# EAGLE design interface (EAGLE 7.7.0)
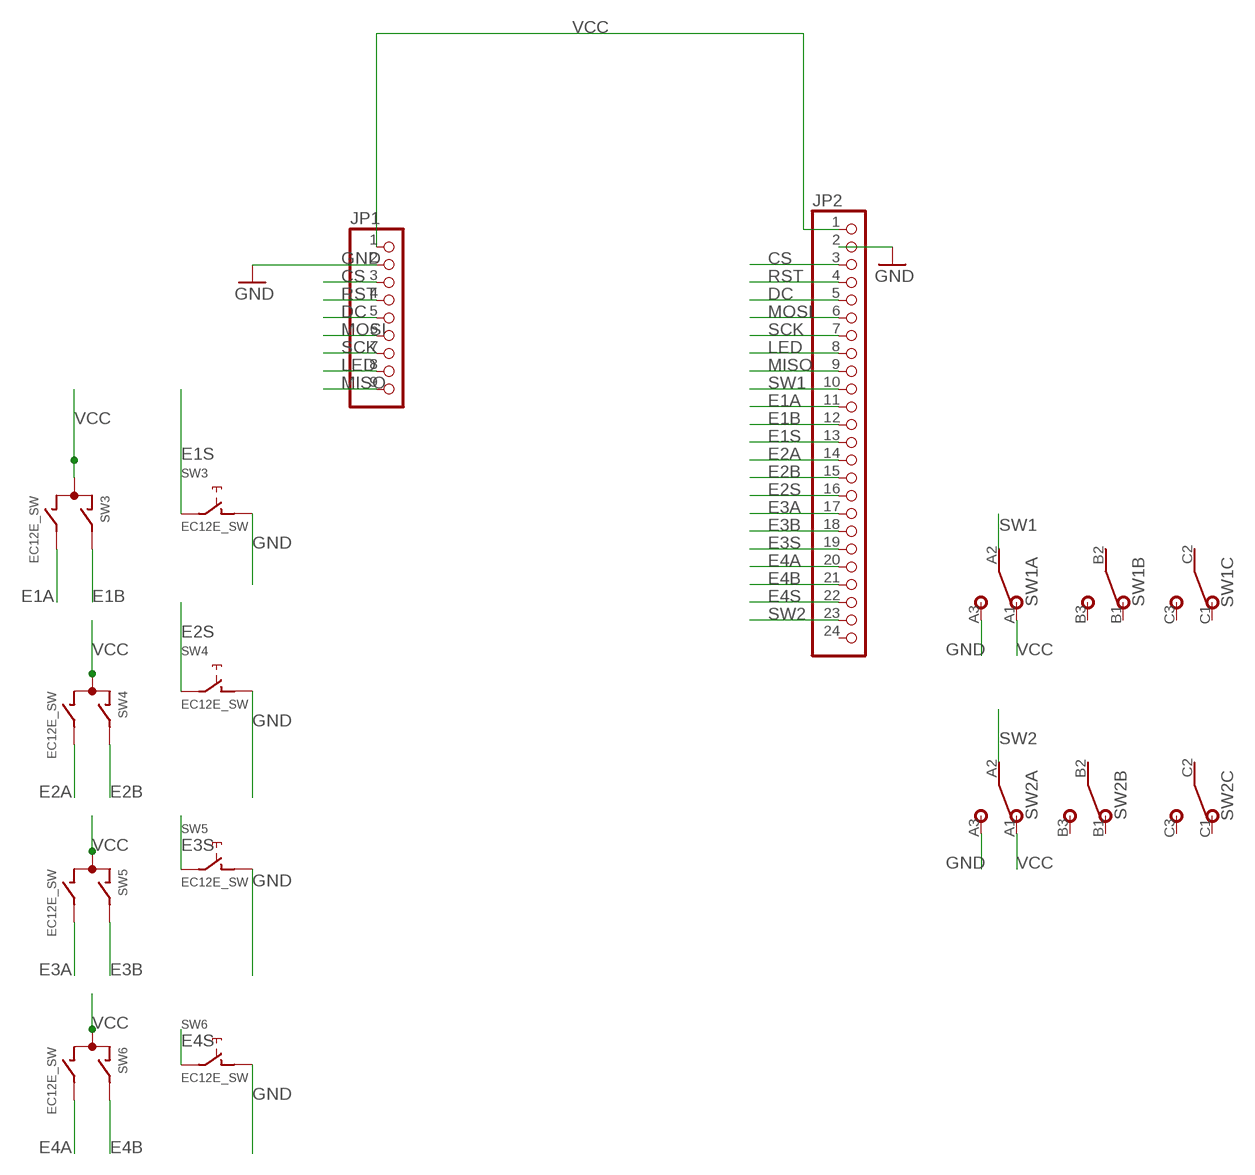
[diagram p0: schematic, sheet 1]

## Parts
JP1  PINHD-1X9  [1X09]
JP2  PINHD-1X24  [1X24]
SW1  3PDTBLUE  [CHINABLUE]
SW2  3PDTBLUE  [CHINABLUE]
SW3  EC12E_SW  [ALPS_EC12E_SW]
SW4  EC12E_SW  [ALPS_EC12E_SW]
SW5  EC12E_SW  [ALPS_EC12E_SW]
SW6  EC12E_SW  [ALPS_EC12E_SW]

## Nets
CS: JP1.3 JP2.3
DC: JP1.5 JP2.5
E1A: JP2.11 SW3.B
E1B: JP2.12 SW3.A
E1S: JP2.13 SW3.E
E2A: JP2.14 SW4.B
E2B: JP2.15 SW4.A
E2S: JP2.16 SW4.E
E3A: JP2.17 SW5.B
E3B: JP2.18 SW5.A
E3S: JP2.19 SW5.E
E4A: JP2.20 SW6.B
E4B: JP2.21 SW6.A
E4S: JP2.22 SW6.E
GND: JP1.2 JP2.2 SW1.A3 SW2.A3 SW3.D SW4.D SW5.D SW6.D
LED: JP1.8 JP2.8
MISO: JP1.9 JP2.9
MOSI: JP1.6 JP2.6
RST: JP1.4 JP2.4
SCK: JP1.7 JP2.7
SW1: JP2.10 SW1.A2
SW2: JP2.23 SW2.A2
VCC: JP1.1 JP2.1 SW1.A1 SW2.A1 SW3.C SW4.C SW5.C SW6.C
Unconnected: JP2.24 SW1.B1 SW1.B2 SW1.B3 SW1.C1 SW1.C2 SW1.C3 SW2.B1 SW2.B2 SW2.B3 SW2.C1 SW2.C2 SW2.C3 SW3.GND1(G) SW3.GND2(G) SW4.GND1(G) SW4.GND2(G) SW5.GND1(G) SW5.GND2(G) SW6.GND1(G) SW6.GND2(G)

## Library data of the parts
JP1 = pinhead:PINHD-1X9: PIN HEADER
JP2 = pinhead:PINHD-1X24: PIN HEADER
SW1 SW2 = gm-switches:3PDT
SW3-SW6 = switch-alps:EC12E_SW: ALPS rotary Encoder EC12E series with switch; MPN: EC12E2424407; OC_FARNELL: 1520813; OC_NEWARK: 74M1068

## Board
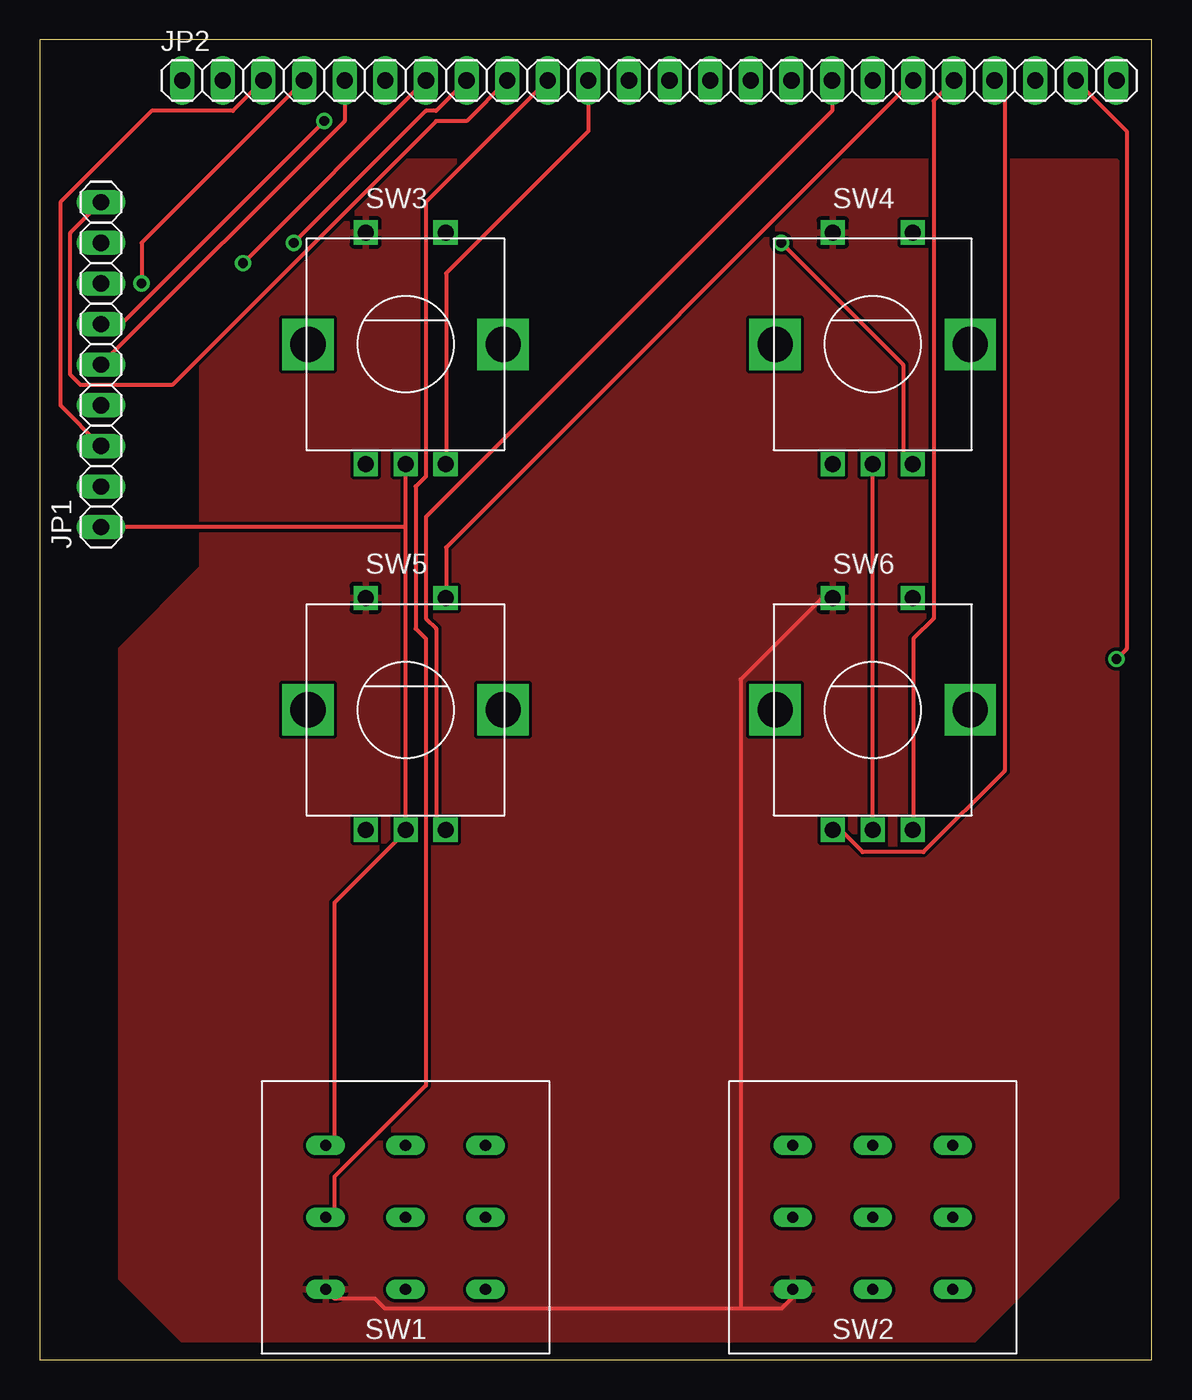
[diagram p1: board, top side]
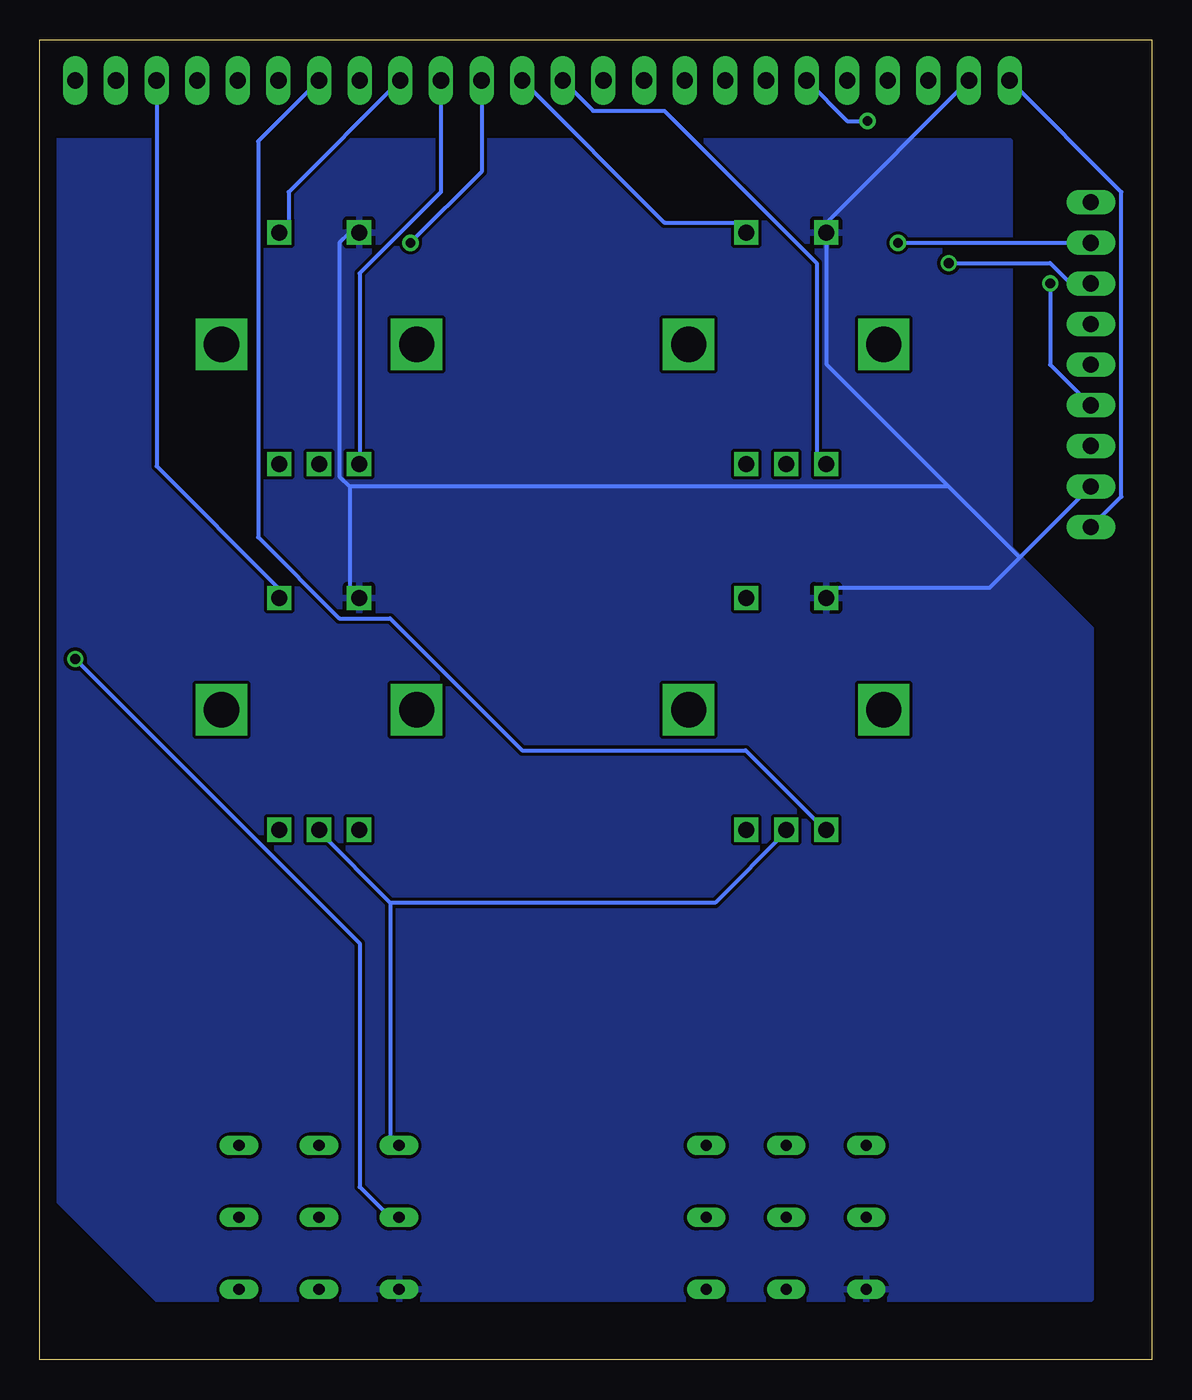
[diagram p2: board, bottom side, seen from below]

Size 69.52 x 82.54 mm. Coordinates in mm from the lower left corner, seen from the top.
Outline: 0,0 69.52,0 69.52,82.54 0,82.54 0,0
Copper layers (1*16): Top 0.035mm / dielectric 1.5mm / Bottom 0.035mm
Design rules "default": minimum track width 10mil, minimum drill 24mil, track to track 8mil, track to pad 8mil, pad to pad 8mil, via to via 8mil, smd to smd 8mil, copper to edge 40mil, drill to drill 8mil, minimum pad ring 10mil, minimum via ring 8mil, stop-mask expansion 4mil, vias tented up to drill 0mil, thermal gap 10mil

### Footprints (pad centres in the part's own frame; a part is rotated, then mirrored left to right if it is on the bottom)
1X09 = drill 1.016 long: 1 -10.16,0; 2 -7.62,0; 3 -5.08,0; 4 -2.54,0; 5 0,0; 6 2.54,0; 7 5.08,0; 8 7.62,0; 9 10.16,0
1X24 = drill 1.016 long: 1 -29.21,0; 2 -26.67,0; 3 -24.13,0; 4 -21.59,0; 5 -19.05,0; 6 -16.51,0; 7 -13.97,0; 8 -11.43,0; 9 -8.89,0; 10 -6.35,0; 11 -3.81,0; 12 -1.27,0; 13 1.27,0; 14 3.81,0; 15 6.35,0; 16 8.89,0; 17 11.43,0; 18 13.97,0; 19 16.51,0; 20 19.05,0; 21 21.59,0; 22 24.13,0; 23 26.67,0; 24 29.21,0
CHINABLUE = drill 0.7 long: A1 -5,4.5; A2 -5,0; A3 -5,-4.5; B1 0,4.5; B2 0,0; B3 0,-4.5; C1 5,4.5; C2 5,0; C3 5,-4.5
ALPS_EC12E_SW = drill 1 square: A -2.5,-7.5; B 2.5,-7.5; C 0,-7.5; D -2.5,7; E 2.5,7 | drill 2.2 square: GND1 -6.1,0; GND2 6.1,0

### Placement (x,y rotation side)
JP1  3.81,62.23 90 top
JP2  38.1,80.01 0 top
SW1  22.86,8.89 0 top
SW2  52.07,8.89 0 top
SW3  22.86,63.5 0 top
SW4  52.07,63.5 0 top
SW5  22.86,40.64 0 top
SW6  52.07,40.64 0 top

### Tracks (layer width: path | path; a pad name or v marks a point on that pad's centre or on a via)
CS
  Top 0.254: JP1.3 1.27,59.69 1.27,72.39 6.98,78.11 12.07,78.11 JP2.3
DC
  Top 0.254: JP1.5 19.05,77.47 JP2.5
E1A
  Top 0.254: JP2.11 34.29,76.84 25.4,67.95 25.4,56.52 SW3.B
E1B
  Bottom 0.254: JP2.12 34.92,78.11 30.48,78.11 20.95,68.58 20.95,56.52 SW3.A
E1S
  Bottom 0.254: JP2.13 30.48,71.12 25.4,71.12 SW3.E
E2A  (via drill 0.61)
  Top 0.254: v46.36,69.85 53.98,62.23 53.98,56.52 SW4.B
  Bottom 0.254: v46.36,69.85 41.91,74.3 JP2.14
E2B
  Bottom 0.254: JP2.15 44.45,73.03 49.53,67.95 49.53,56.52 SW4.A
E2S
  Bottom 0.254: JP2.16 53.98,73.03 53.98,71.12 SW4.E
E3A
  Top 0.254: JP2.17 49.53,78.11 24.13,52.71 24.13,46.36 24.76,45.72 24.76,33.66 SW5.B
E3B
  Bottom 0.254: JP2.18 55.88,76.2 55.88,51.44 50.8,46.36 47.62,46.36 39.37,38.1 25.4,38.1 20.95,33.66 SW5.A
E3S
  Top 0.254: JP2.19 25.4,50.8 25.4,48.26 SW5.E
E4A
  Top 0.254: JP2.20 55.88,78.74 55.88,46.36 54.61,45.09 54.61,33.66 SW6.B
E4B
  Top 0.254: JP2.21 60.33,79.38 60.33,36.83 55.25,31.75 51.44,31.75 50.16,33.02 SW6.A
E4S
  Bottom 0.254: JP2.22 62.23,55.88 54.61,48.26 SW6.E
GND
  Top 0.254: 43.82,3.17 46.36,3.17 46.99,3.81 SW2.A3 | 43.82,3.17 21.59,3.17 20.95,3.81 18.41,3.81 SW1.A3 | 43.82,3.17 43.82,42.55 49.53,48.26 SW6.D
  Bottom 0.254: 50.16,54.61 50.16,48.26 SW6.D | 50.16,54.61 50.8,55.25 50.8,69.85 50.16,70.48 SW4.D | JP2.2 20.32,71.12 SW3.D 20.32,70.48 20.32,62.23 12.7,54.61 | JP1.2 8.26,50.16 | 8.26,50.16 10.16,48.26 20.32,48.26 SW5.D | 8.26,50.16 12.7,54.61 | 12.7,54.61 50.16,54.61
  pour Bottom: 3.81,3.81 3.81,44.45 3.81,45.72 8.89,50.8 8.89,76.2 68.58,76.2 68.58,10.16 62.23,3.81
  pour Top: 5.08,5.08 5.08,44.45 10.16,49.53 10.16,71.12 11.43,72.39 13.97,74.93 67.31,74.93 67.31,10.16 58.42,1.27 8.89,1.27
LED  (via drill 0.61)
  Top 0.254: v15.88,69.85 24.13,78.11 24.76,78.11 JP2.8
  Bottom 0.254: v15.88,69.85 JP1.8
MISO
  Top 0.254: JP1.9 1.91,70.48 1.91,61.59 2.54,60.96 8.26,60.96 24.76,77.47 26.67,77.47 JP2.9
MOSI  (via drill 0.61)
  Top 0.254: JP1.6 5.08,64.77 v17.78,77.47
  Bottom 0.254: v17.78,77.47 19.05,77.47 JP2.6
RST  (via drill 0.61)
  Top 0.254: v6.35,67.31 6.35,69.85 JP2.4
  Bottom 0.254: JP1.4 6.35,62.23 v6.35,67.31
SCK  (via drill 0.61)
  Top 0.254: JP2.7 v12.7,68.58
  Bottom 0.254: JP1.7 5.08,67.31 6.35,68.58 v12.7,68.58
SW1
  Top 0.254: JP2.10 24.13,72.39 24.13,55.25 23.49,54.61 23.49,45.72 24.13,45.09 24.13,17.14 18.41,11.43 18.41,8.89 SW1.A2
SW2  (via drill 0.61)
  Top 0.254: v67.31,43.82 67.95,44.45 67.95,76.84 JP2.23
  Bottom 0.254: v67.31,43.82 49.53,26.04 49.53,10.79 47.62,8.89 SW2.A2
VCC
  Top 0.254: SW6.C SW4.C | SW1.A1 18.41,13.97 18.41,28.57 22.86,33.02 SW5.C 22.86,52.07 | 22.86,52.07 SW3.C | 22.86,52.07 JP1.1
  Bottom 0.254: 47.62,28.57 47.62,13.97 SW2.A1 | 47.62,28.57 52.07,33.02 SW6.C | JP2.1 1.91,73.03 1.91,53.98 JP1.1 | 47.62,28.57 27.3,28.57 22.86,33.02 SW5.C